# Altium schematic sheet 59170-1-S-00-D59170-1-S-00-D.schdoc
size 127 x 101 mm
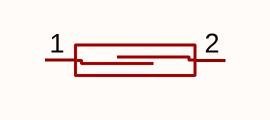
[diagram p0: 59170-1-S-00-D59170-1-S-00-D.schdoc]

## Parts
U?  59170-1-S-00-D  (value not drawn)

## Nets

Not connected (* = marked no-connect by the designer): U? 1 2

## Library data of the parts
U? = 59170-1-S-00-D: Symbol: 59170-1-S-00-D